# Altium schematic sheet Hambmark_PCB-practice-STM32-two-wheel-balancing-car__OTHER_SCHDOC__HDSP-7801.schdoc
size 57 x 37 mm
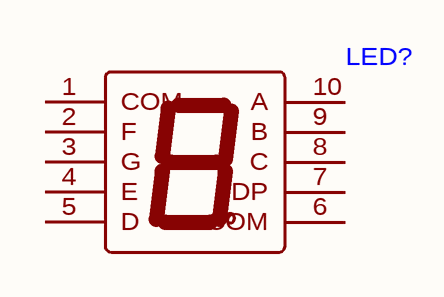
[diagram p0: Hambmark_PCB-practice-STM32-two-wheel-balancing-car__OTHER_SCHDOC__HDSP-7801.schdoc]

## Parts
LED?  (no value)  [LED-SEG-SMD_HDSP-7801]

## Nets

Not connected (* = marked no-connect by the designer): LED? 1(COM) 2(F) 3(G) 4(E) 5(D) 6(COM) 7(DP) 8(C) 9(B) 10(A)

## Library data of the parts
LED? = HDSP-7801